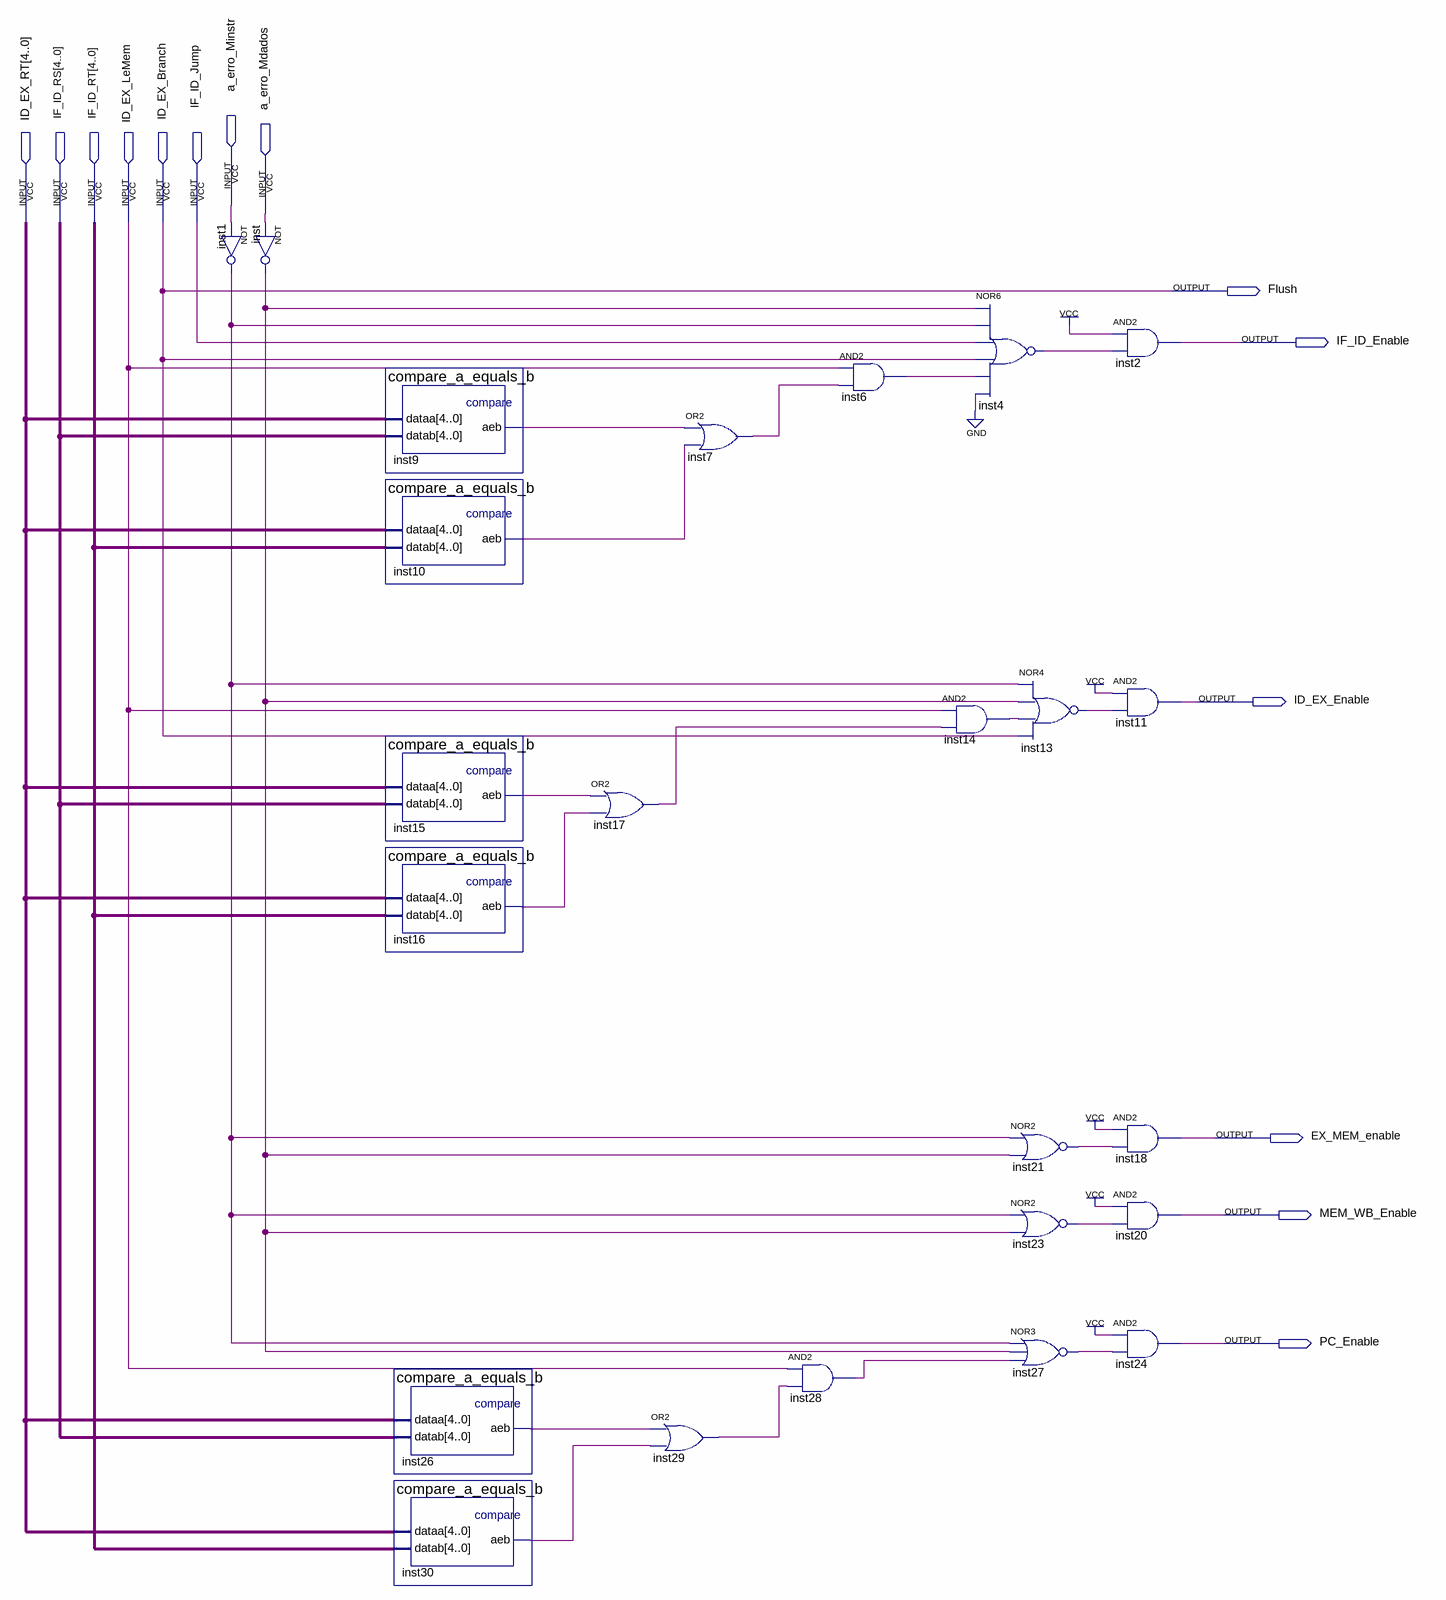
[diagram p0: schematic sheet]
// Quartus schematic hazard_unit.bdf as structural Verilog: 24 symbols, 14 pins
module hazard_unit (
  input  a_erro_Minstr,
  input  a_erro_Mdados,
  input  [4:0] ID_EX_RT,
  input  [4:0] IF_ID_RS,
  input  [4:0] IF_ID_RT,
  input  ID_EX_LeMem,
  input  ID_EX_Branch,
  input  IF_ID_Jump,
  output Flush,
  output IF_ID_Enable,
  output ID_EX_Enable,
  output EX_MEM_enable,
  output MEM_WB_Enable,
  output PC_Enable
);

  wire inst1_out, inst4_out, inst6_out, inst7_out, inst9_aeb, inst10_aeb, inst13_out, inst14_out, inst15_aeb,
       inst16_aeb, inst17_out, inst21_out, inst23_out, inst26_aeb, inst27_out, inst28_out, inst29_out,
       inst30_aeb, inst_out;

  not inst (inst_out, a_erro_Mdados);
  not inst1 (inst1_out, a_erro_Minstr);
  compare_a_equals_b inst9 (.dataa(ID_EX_RT), .datab(IF_ID_RS), .aeb(inst9_aeb));
  compare_a_equals_b inst10 (.dataa(ID_EX_RT), .datab(IF_ID_RT), .aeb(inst10_aeb));
  compare_a_equals_b inst15 (.dataa(ID_EX_RT), .datab(IF_ID_RS), .aeb(inst15_aeb));
  compare_a_equals_b inst16 (.dataa(ID_EX_RT), .datab(IF_ID_RT), .aeb(inst16_aeb));
  compare_a_equals_b inst26 (.dataa(ID_EX_RT), .datab(IF_ID_RS), .aeb(inst26_aeb));
  compare_a_equals_b inst30 (.dataa(ID_EX_RT), .datab(IF_ID_RT), .aeb(inst30_aeb));
  or inst17 (inst17_out, inst15_aeb, inst16_aeb);
  or inst29 (inst29_out, inst26_aeb, inst30_aeb);
  or inst7 (inst7_out, inst9_aeb, inst10_aeb);
  and inst28 (inst28_out, ID_EX_LeMem, inst29_out);
  and inst6 (inst6_out, ID_EX_LeMem, inst7_out);
  and inst14 (inst14_out, ID_EX_LeMem, inst17_out);
  nor inst4 (inst4_out, inst_out, inst1_out, IF_ID_Jump, ID_EX_Branch, inst6_out, 1'b0);
  nor inst21 (inst21_out, inst1_out, inst_out);
  nor inst23 (inst23_out, inst1_out, inst_out);
  nor inst27 (inst27_out, inst1_out, inst_out, inst28_out);
  nor inst13 (inst13_out, inst1_out, inst_out, inst14_out, ID_EX_Branch);
  and inst2 (IF_ID_Enable, 1'b1, inst4_out);
  and inst11 (ID_EX_Enable, 1'b1, inst13_out);
  and inst18 (EX_MEM_enable, 1'b1, inst21_out);
  and inst20 (MEM_WB_Enable, 1'b1, inst23_out);
  and inst24 (PC_Enable, 1'b1, inst27_out);

  assign Flush = ID_EX_Branch;
endmodule
